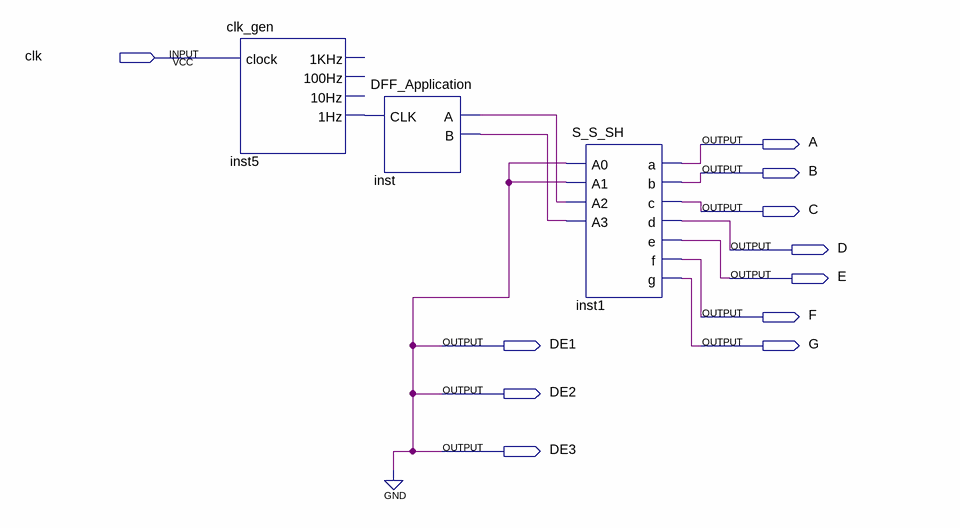
[diagram p0: schematic sheet]
// Quartus schematic showing_one_two_three.bdf as structural Verilog: 3 symbols, 11 pins
module showing_one_two_three (
  input  clk,
  output A,
  output B,
  output C,
  output D,
  output E,
  output F,
  output DE1,
  output G,
  output DE2,
  output DE3
);

  wire inst5_1hz, inst_a, inst_b;

  clk_gen inst5 (.clock(clk), .\1Hz (inst5_1hz));  // open: 1KHz, 100Hz, 10Hz
  DFF_Application inst (.CLK(inst5_1hz), .A(inst_a), .B(inst_b));
  S_S_SH inst1 (.A0(1'b0), .A1(1'b0), .A2(inst_a), .A3(inst_b), .a(A), .b(B), .c(C), .d(D), .e(E), .f(F), .g(G));

  assign DE1 = 1'b0;
  assign DE2 = 1'b0;
  assign DE3 = 1'b0;
endmodule
